# Altium schematic sheet LPCB227 - OVERVIEW.SchDoc
size A3; Address1: Factory 10; Address2: 9-13 Dingley Avenue, Dandeong, VICTORIA 3175, AUSTRALIA; DocumentNumber: 1; Revision: 1; SheetNumber: 1; SheetTotal: 4; Lockie__PCB_SUB_ASSEMBLY: Overview; Lockie__PCB_ASSEMBLY: Main; Lockie__LDL: LPCB227; Lockie__PCB_DESCRIPTION: Accelerometer Module
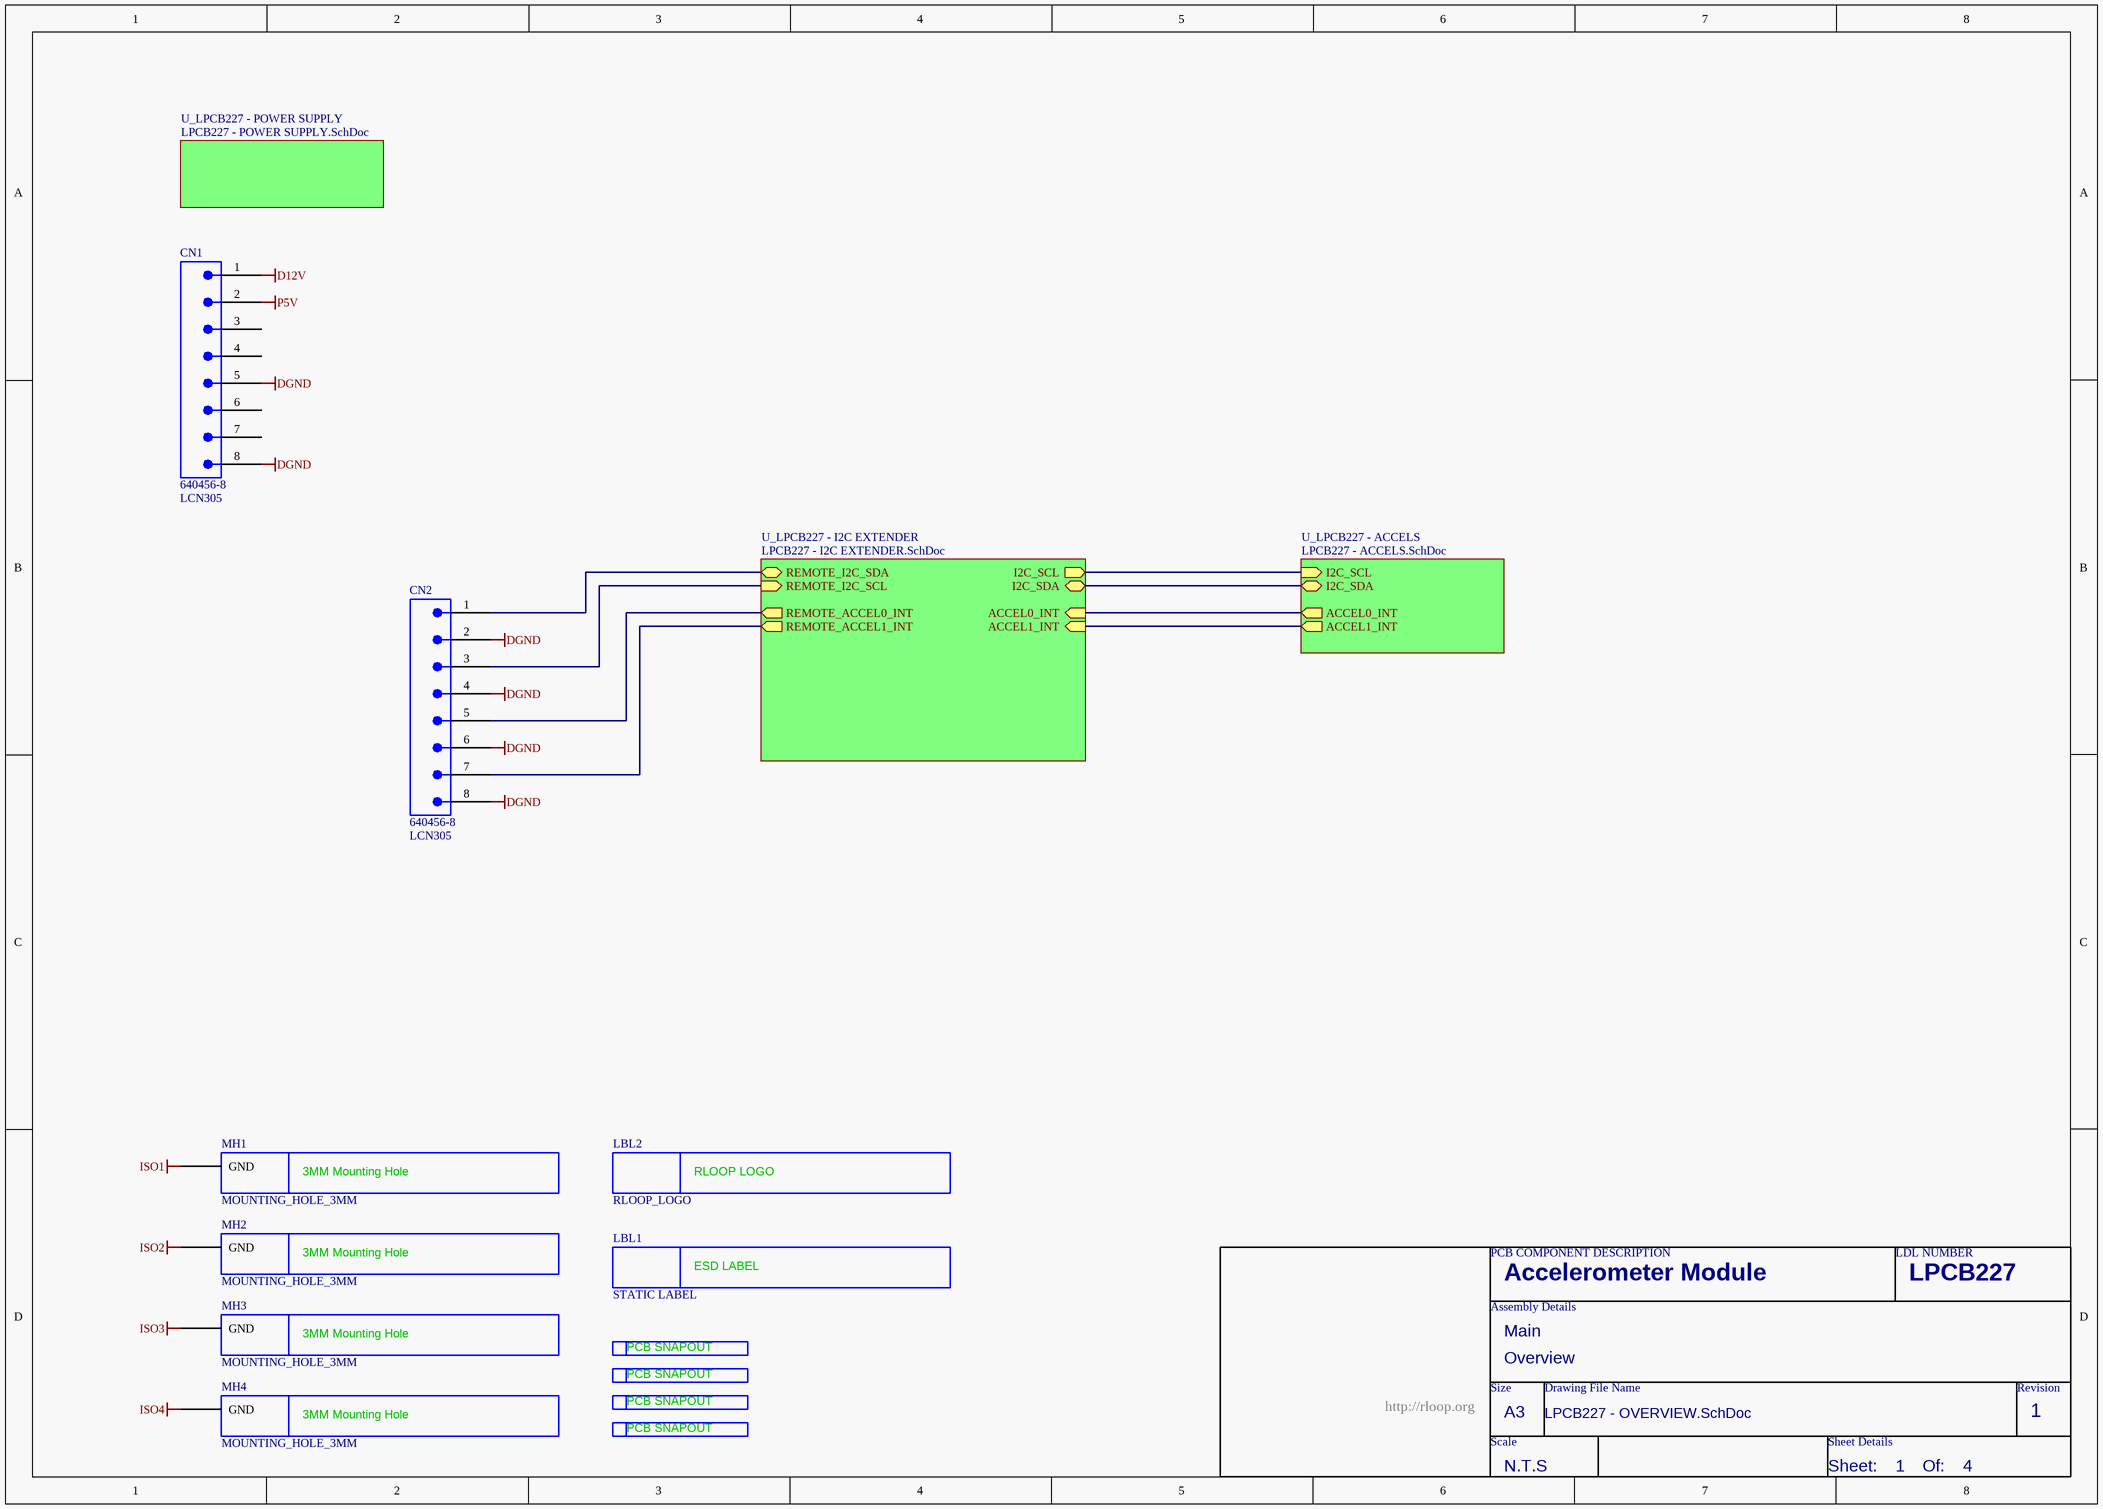
[diagram p0: LPCB227 - OVERVIEW.SchDoc]

## Parts
CN1  640456-8  LDL_NUMBER: LCN305  [640456-8]
CN2  640456-8  LDL_NUMBER: LCN305  [640456-8]
LBL1  STATIC LABEL  [STATIC_LABEL]  (no BOM)
LBL2  RLOOP_LOGO  [RLOOP_LOGO]  (no BOM)
MH1  MOUNTING_HOLE_3MM  [MOUNTING_HOLE_3MM]  (no BOM)
MH2  MOUNTING_HOLE_3MM  [MOUNTING_HOLE_3MM]  (no BOM)
MH3  MOUNTING_HOLE_3MM  [MOUNTING_HOLE_3MM]  (no BOM)
MH4  MOUNTING_HOLE_3MM  [MOUNTING_HOLE_3MM]  (no BOM)
SN1  PCB_SNAPOUT  [SNAPOUT_NEW]  (value not drawn)  (no BOM)
SN2  PCB_SNAPOUT  [SNAPOUT_NEW]  (value not drawn)  (no BOM)
SN3  PCB_SNAPOUT  [SNAPOUT_NEW]  (value not drawn)  (no BOM)
SN4  PCB_SNAPOUT  [SNAPOUT_NEW]  (value not drawn)  (no BOM)

## Sub-sheets
U_LPCB227 - ACCELS = LPCB227 - ACCELS.SchDoc: I2C_SCL (in), I2C_SDA (bidir), ACCEL0_INT (out), ACCEL1_INT (out)
U_LPCB227 - I2C EXTENDER = LPCB227 - I2C EXTENDER.SchDoc: REMOTE_I2C_SDA (bidir), REMOTE_I2C_SCL (in), I2C_SCL (out), I2C_SDA (bidir), ACCEL0_INT (in), ACCEL1_INT (in), REMOTE_ACCEL0_INT (out), REMOTE_ACCEL1_INT (out)
U_LPCB227 - POWER SUPPLY = LPCB227 - POWER SUPPLY.SchDoc: no entries

## Nets
D12V: CN1.1
DGND: CN1.5 CN1.8 CN2.2 CN2.4 CN2.6 CN2.8
ISO1: MH1.MOUNT(GND)
ISO2: MH2.MOUNT(GND)
ISO3: MH3.MOUNT(GND)
ISO4: MH4.MOUNT(GND)
P5V: CN1.2
NetCN2_1: CN2.1 ; sheet U_LPCB227 - I2C EXTENDER/REMOTE_I2C_SDA
NetCN2_3: CN2.3 ; sheet U_LPCB227 - I2C EXTENDER/REMOTE_I2C_SCL
NetCN2_5: CN2.5 ; sheet U_LPCB227 - I2C EXTENDER/REMOTE_ACCEL0_INT
NetCN2_7: CN2.7 ; sheet U_LPCB227 - I2C EXTENDER/REMOTE_ACCEL1_INT
(unnamed): sheet U_LPCB227 - ACCELS/I2C_SCL, sheet U_LPCB227 - I2C EXTENDER/I2C_SCL
(unnamed): sheet U_LPCB227 - ACCELS/I2C_SDA, sheet U_LPCB227 - I2C EXTENDER/I2C_SDA
(unnamed): sheet U_LPCB227 - ACCELS/ACCEL0_INT, sheet U_LPCB227 - I2C EXTENDER/ACCEL0_INT
(unnamed): sheet U_LPCB227 - ACCELS/ACCEL1_INT, sheet U_LPCB227 - I2C EXTENDER/ACCEL1_INT

Not connected (* = marked no-connect by the designer): CN1 3 4 6 7

## Notes on the sheet
- PCB COMPONENT DESCRIPTION
- LDL NUMBER
- Assembly Details
- Size
- Drawing File Name
- Revision
- http://rloop.org
- Scale
- A3
- Sheet Details
- N.T.S
- Sheet:
- Of:
- (in symbol MOUNTING_HOLE_3MM) 3MM Mounting Hole
- (in symbol PCB_SNAPOUT) PCB SNAPOUT
- (in symbol RLOOP_LOGO) RLOOP LOGO
- (in symbol STATIC LABEL) ESD LABEL

## Library data of the parts
CN1 CN2 = 640456-8: Connector, Male Header, 8 Way; FMEDA__CHANNEL: COM; FMEDA__OPERATING__CURRENT_MAX: 0; FMEDA__OPERATING__TEMP_MAX: 50; FMEDA__OPERATING__TEMP_MIN: -20; FMEDA__OPERATING__TEMP_TYP: 27; FMEDA__OPERATING__VOLTAGE_MAX: 16; FMEDA__OPERATING__VOLTAGE_TYP: 12; FMEDA__FUNCTION_IN_SYSTEM: *; FMEDA__OPERATING__CURRENT_MIN: 0; FMEDA__OPERATING__CURRENT_TYP: 0; FMEDA__OPERATING__VOLTAGE_MIN: 0
LBL1 = STATIC LABEL: FMEDA__CHANNEL: DIAG; FMEDA__FUNCTION_IN_SYSTEM: *
LBL2 = RLOOP_LOGO: FMEDA__CHANNEL: DIAG; FMEDA__FUNCTION_IN_SYSTEM: *
MH1-MH4 = MOUNTING_HOLE_3MM: 3MM Mouting Hole; FMEDA__CHANNEL: DIAG; FMEDA__FUNCTION_IN_SYSTEM: *
SN1-SN4 = PCB_SNAPOUT: FMEDA__CHANNEL: DIAG; FMEDA__FUNCTION_IN_SYSTEM: *